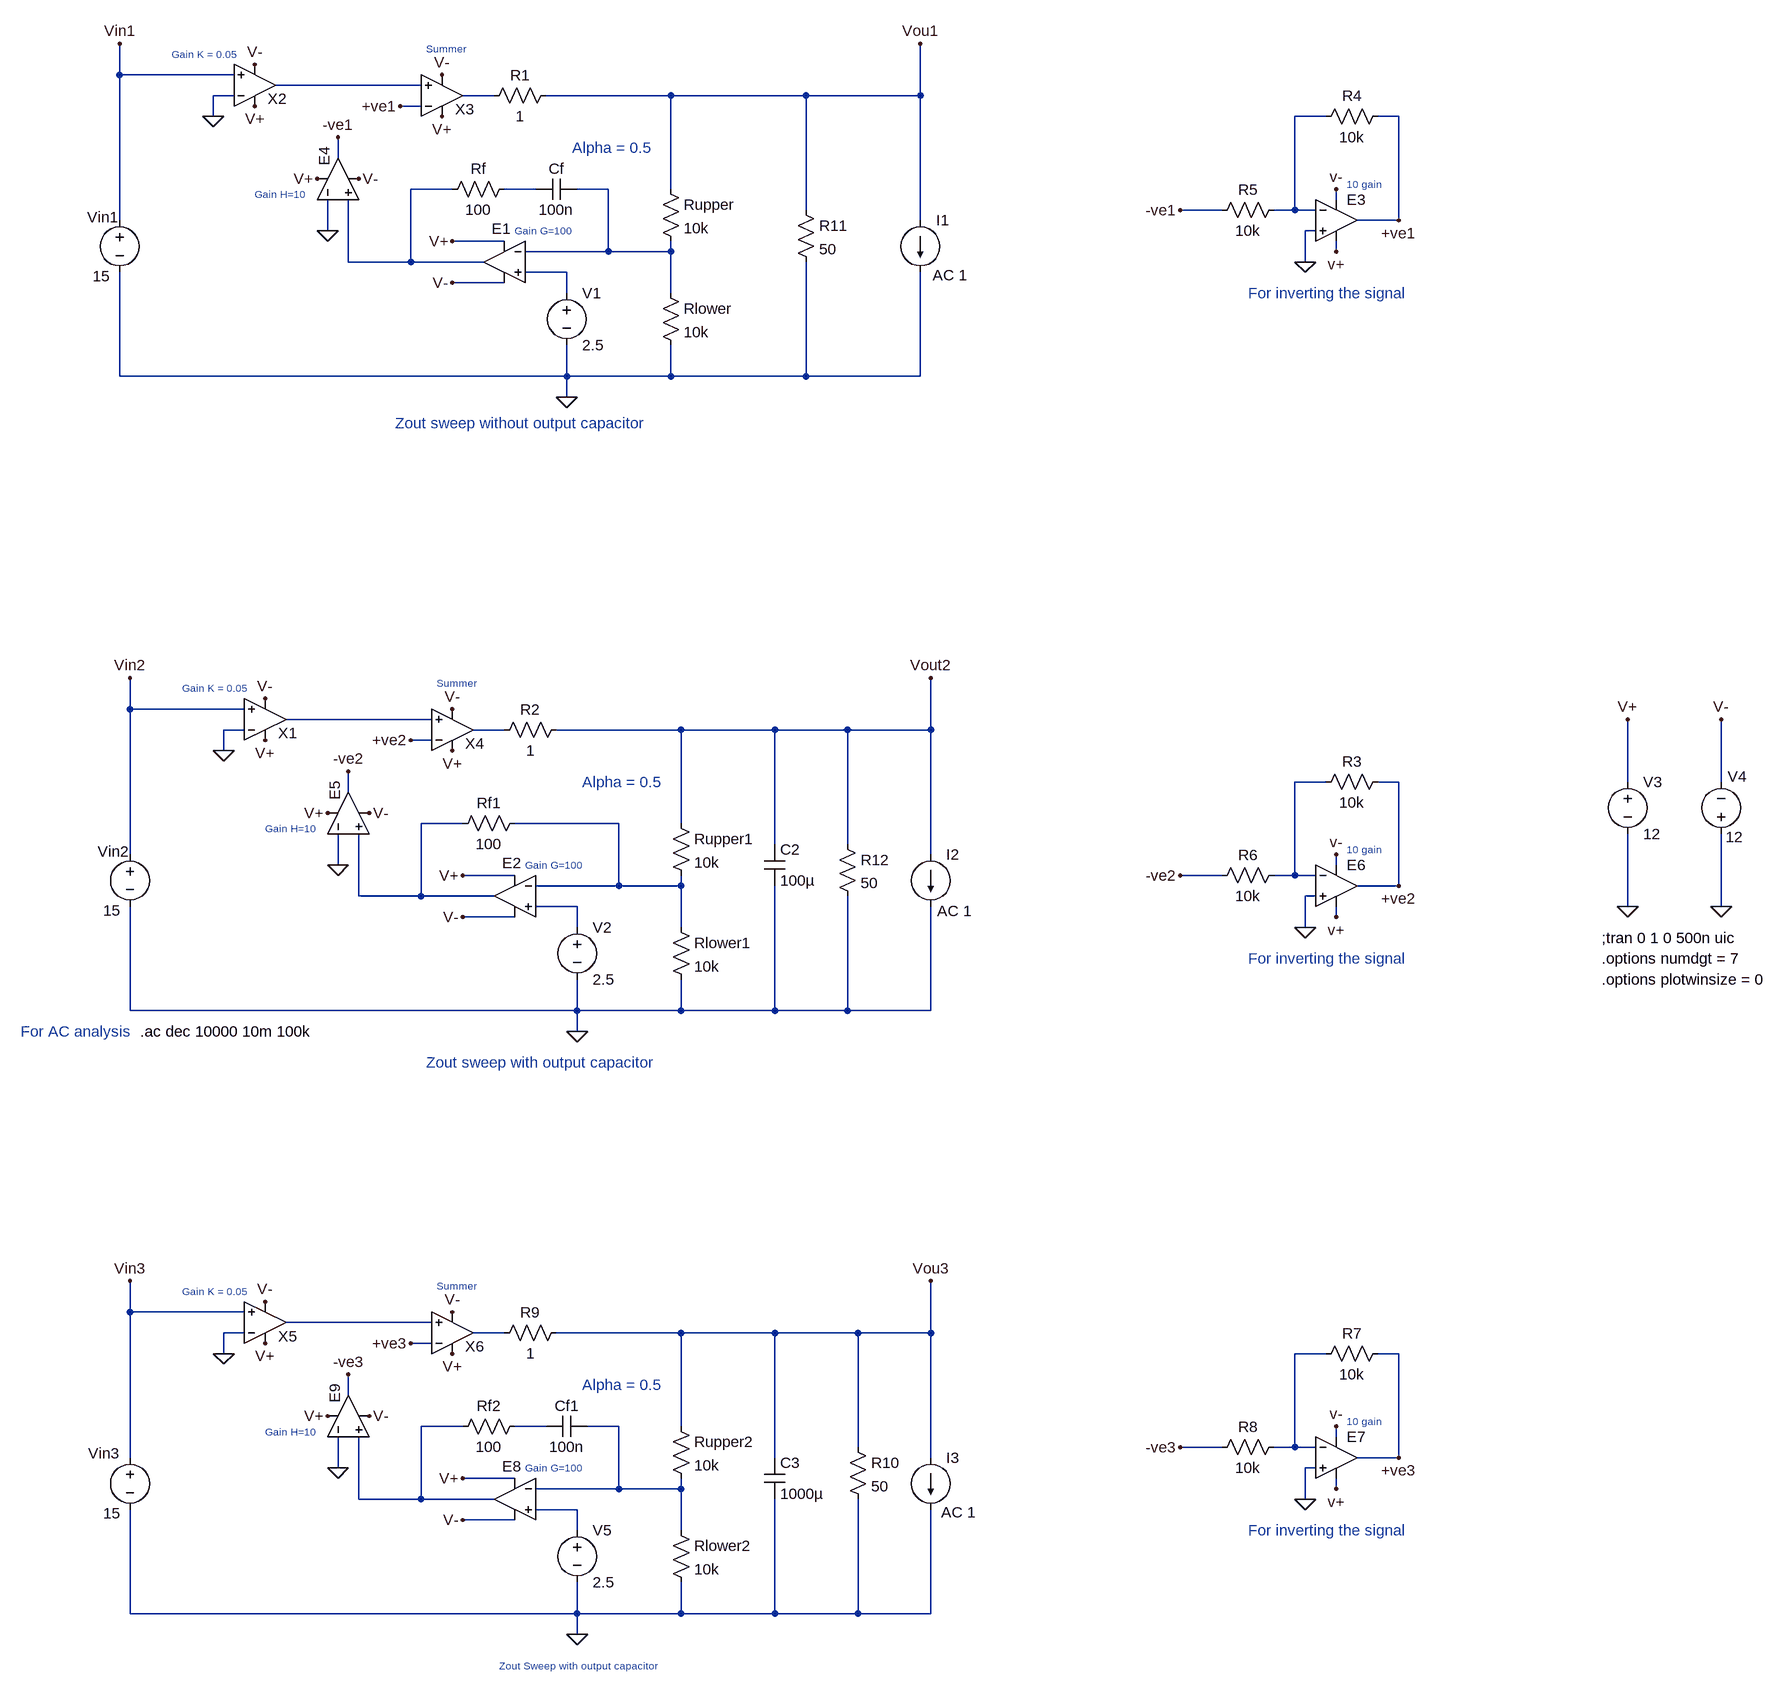
[diagram p0: schematic LDO - Closed Loop_Capacitor Sweep.asc]
LDO - Closed Loop_Capacitor Sweep.asc, the LTspice schematic file:
Version 4
SHEET 1 2436 2412
WIRE -416 -80 -416 -128
WIRE -240 -80 -416 -80
WIRE 48 -64 -176 -64
WIRE -240 -48 -272 -48
WIRE 160 -48 112 -48
WIRE 432 -48 240 -48
WIRE 640 -48 432 -48
WIRE 816 -48 816 -128
WIRE 816 -48 640 -48
WIRE 48 -32 16 -32
WIRE -272 -16 -272 -48
WIRE 1440 -16 1392 -16
WIRE 1552 -16 1520 -16
WIRE -80 48 -80 16
WIRE 96 96 32 96
WIRE 224 96 176 96
WIRE 336 96 288 96
WIRE 432 96 432 -48
WIRE 1456 112 1456 96
WIRE 640 128 640 -48
WIRE 1280 128 1216 128
WIRE 1392 128 1392 -16
WIRE 1392 128 1360 128
WIRE 1424 128 1392 128
WIRE -416 144 -416 -80
WIRE 816 144 816 -48
WIRE 1552 144 1552 -16
WIRE 1552 144 1488 144
WIRE -96 160 -96 112
WIRE 1424 160 1408 160
WIRE 176 176 96 176
WIRE 336 192 336 96
WIRE 336 192 208 192
WIRE 432 192 432 176
WIRE 432 192 336 192
WIRE 1456 192 1456 176
WIRE -64 208 -64 112
WIRE 32 208 32 96
WIRE 32 208 -64 208
WIRE 144 208 32 208
WIRE 1408 208 1408 160
WIRE 272 224 208 224
WIRE 176 240 96 240
WIRE 272 256 272 224
WIRE 432 256 432 192
WIRE -416 384 -416 224
WIRE 272 384 272 336
WIRE 272 384 -416 384
WIRE 432 384 432 336
WIRE 432 384 272 384
WIRE 640 384 640 208
WIRE 640 384 432 384
WIRE 816 384 816 224
WIRE 816 384 640 384
WIRE 272 416 272 384
WIRE -400 896 -400 848
WIRE -224 896 -400 896
WIRE 64 912 -160 912
WIRE -224 928 -256 928
WIRE 176 928 128 928
WIRE 448 928 256 928
WIRE 592 928 448 928
WIRE 704 928 592 928
WIRE 832 928 832 848
WIRE 832 928 704 928
WIRE 64 944 32 944
WIRE -256 960 -256 928
WIRE 1440 1008 1392 1008
WIRE 1552 1008 1520 1008
WIRE 1904 1008 1904 912
WIRE 2048 1008 2048 912
WIRE -64 1024 -64 992
WIRE 112 1072 48 1072
WIRE 352 1072 192 1072
WIRE 448 1072 448 928
WIRE 592 1104 592 928
WIRE 704 1104 704 928
WIRE -400 1120 -400 896
WIRE 832 1120 832 928
WIRE -80 1136 -80 1088
WIRE 1456 1136 1456 1120
WIRE 192 1152 112 1152
WIRE 1280 1152 1216 1152
WIRE 1392 1152 1392 1008
WIRE 1392 1152 1360 1152
WIRE 1424 1152 1392 1152
WIRE 352 1168 352 1072
WIRE 352 1168 224 1168
WIRE 448 1168 448 1152
WIRE 448 1168 352 1168
WIRE 1552 1168 1552 1008
WIRE 1552 1168 1488 1168
WIRE -48 1184 -48 1088
WIRE 48 1184 48 1072
WIRE 48 1184 -48 1184
WIRE 160 1184 48 1184
WIRE 1424 1184 1408 1184
WIRE 288 1200 224 1200
WIRE 1904 1200 1904 1088
WIRE 2048 1200 2048 1088
WIRE 192 1216 112 1216
WIRE 1456 1216 1456 1200
WIRE 288 1232 288 1200
WIRE 448 1232 448 1168
WIRE 1408 1232 1408 1184
WIRE -400 1360 -400 1200
WIRE 288 1360 288 1312
WIRE 288 1360 -400 1360
WIRE 448 1360 448 1312
WIRE 448 1360 288 1360
WIRE 592 1360 592 1168
WIRE 592 1360 448 1360
WIRE 704 1360 704 1184
WIRE 704 1360 592 1360
WIRE 832 1360 832 1200
WIRE 832 1360 704 1360
WIRE 288 1392 288 1360
WIRE -400 1824 -400 1776
WIRE -224 1824 -400 1824
WIRE 64 1840 -160 1840
WIRE -224 1856 -256 1856
WIRE 176 1856 128 1856
WIRE 448 1856 256 1856
WIRE 592 1856 448 1856
WIRE 720 1856 592 1856
WIRE 832 1856 832 1776
WIRE 832 1856 720 1856
WIRE 64 1872 32 1872
WIRE -256 1888 -256 1856
WIRE 1440 1888 1392 1888
WIRE 1552 1888 1520 1888
WIRE -64 1952 -64 1920
WIRE 112 2000 48 2000
WIRE 240 2000 192 2000
WIRE 352 2000 304 2000
WIRE 448 2000 448 1856
WIRE 1456 2016 1456 2000
WIRE 720 2032 720 1856
WIRE 1280 2032 1216 2032
WIRE 1392 2032 1392 1888
WIRE 1392 2032 1360 2032
WIRE 1424 2032 1392 2032
WIRE -400 2048 -400 1824
WIRE 592 2048 592 1856
WIRE 832 2048 832 1856
WIRE 1552 2048 1552 1888
WIRE 1552 2048 1488 2048
WIRE -80 2064 -80 2016
WIRE 1424 2064 1408 2064
WIRE 192 2080 112 2080
WIRE 352 2096 352 2000
WIRE 352 2096 224 2096
WIRE 448 2096 448 2080
WIRE 448 2096 352 2096
WIRE 1456 2096 1456 2080
WIRE -48 2112 -48 2016
WIRE 48 2112 48 2000
WIRE 48 2112 -48 2112
WIRE 160 2112 48 2112
WIRE 1408 2112 1408 2064
WIRE 288 2128 224 2128
WIRE 192 2144 112 2144
WIRE 288 2160 288 2128
WIRE 448 2160 448 2096
WIRE -400 2288 -400 2128
WIRE 288 2288 288 2240
WIRE 288 2288 -400 2288
WIRE 448 2288 448 2240
WIRE 448 2288 288 2288
WIRE 592 2288 592 2112
WIRE 592 2288 448 2288
WIRE 720 2288 720 2112
WIRE 720 2288 592 2288
WIRE 832 2288 832 2128
WIRE 832 2288 720 2288
WIRE 288 2320 288 2288
FLAG 96 176 V+
FLAG 96 240 V-
FLAG 1904 1200 0
FLAG 2048 1200 0
FLAG 1904 912 V+
FLAG 2048 912 V-
FLAG 272 416 0
FLAG 1408 208 0
FLAG 1552 144 +ve1
FLAG 1456 96 v-
FLAG 1456 192 v+
FLAG 1216 128 -ve1
FLAG -96 160 0
FLAG -112 80 V+
FLAG -48 80 V-
FLAG -80 16 -ve1
FLAG -208 -32 V+
FLAG -208 -96 V-
FLAG -272 -16 0
FLAG 80 -16 V+
FLAG 80 -80 V-
FLAG 16 -32 +ve1
FLAG 816 -128 Vou1
FLAG -416 -128 Vin1
FLAG 112 1152 V+
FLAG 112 1216 V-
FLAG 288 1392 0
FLAG -80 1136 0
FLAG -96 1056 V+
FLAG -32 1056 V-
FLAG -64 992 -ve2
FLAG -192 944 V+
FLAG -192 880 V-
FLAG -256 960 0
FLAG 96 960 V+
FLAG 96 896 V-
FLAG 32 944 +ve2
FLAG 832 848 Vout2
FLAG -400 848 Vin2
FLAG 1408 1232 0
FLAG 1552 1168 +ve2
FLAG 1456 1120 v-
FLAG 1456 1216 v+
FLAG 1216 1152 -ve2
FLAG 112 2080 V+
FLAG 112 2144 V-
FLAG 288 2320 0
FLAG 1408 2112 0
FLAG 1552 2048 +ve3
FLAG 1456 2000 v-
FLAG 1456 2096 v+
FLAG 1216 2032 -ve3
FLAG -80 2064 0
FLAG -96 1984 V+
FLAG -32 1984 V-
FLAG -64 1920 -ve3
FLAG -192 1872 V+
FLAG -192 1808 V-
FLAG -256 1888 0
FLAG 96 1888 V+
FLAG 96 1824 V-
FLAG 32 1872 +ve3
FLAG 832 1776 Vou3
FLAG -400 1776 Vin3
SYMBOL voltage -416 128 R0
WINDOW 123 0 0 Left 0
WINDOW 39 0 0 Left 0
WINDOW 0 -50 11 Left 2
WINDOW 3 -41 102 Left 2
SYMATTR InstName Vin1
SYMATTR Value 15
SYMBOL voltage 272 240 R0
WINDOW 123 0 0 Left 0
WINDOW 39 0 0 Left 0
SYMATTR InstName V1
SYMATTR Value 2.5
SYMBOL res 416 80 R0
SYMATTR InstName Rupper
SYMATTR Value 10k
SYMBOL res 416 240 R0
SYMATTR InstName Rlower
SYMATTR Value 10k
SYMBOL voltage 1904 992 R0
SYMATTR InstName V3
SYMATTR Value 12
SYMBOL voltage 2048 1104 R180
WINDOW 123 0 0 Left 0
WINDOW 39 0 0 Left 0
WINDOW 0 -39 104 Left 2
WINDOW 3 -34 11 Left 2
SYMATTR InstName V4
SYMATTR Value 12
SYMBOL OpAmps\\UniversalOpAmp1 1456 144 R0
SYMATTR InstName E3
SYMATTR Value2 Avol=10 GBW=10Meg Vos=0
SYMBOL res 1536 -32 R90
WINDOW 0 0 56 VBottom 2
WINDOW 3 32 56 VTop 2
SYMATTR InstName R4
SYMATTR Value 10k
SYMBOL res 1376 112 R90
WINDOW 0 0 56 VBottom 2
WINDOW 3 32 56 VTop 2
SYMATTR InstName R5
SYMATTR Value 10k
SYMBOL OpAmps\\UniversalOpAmp1 176 208 M0
WINDOW 0 -10 -51 Left 2
SYMATTR InstName E1
SYMATTR Value2 Avol=100 GBW=10Meg Vos=0
SYMBOL cap 288 80 R90
WINDOW 0 0 32 VBottom 2
WINDOW 3 32 32 VTop 2
SYMATTR InstName Cf
SYMATTR Value 100n
SYMBOL res 192 80 R90
WINDOW 0 0 56 VBottom 2
WINDOW 3 32 56 VTop 2
SYMATTR InstName Rf
SYMATTR Value 100
SYMBOL OpAmps\\UniversalOpAmp1 -80 80 R270
WINDOW 0 20 -21 Left 2
SYMATTR InstName E4
SYMATTR Value2 Avol=100 GBW=10Meg Vos=0
SYMBOL OpAmps\\UniversalOpAmp1 -208 -64 M180
WINDOW 0 20 -21 Left 2
SYMATTR InstName X2
SYMATTR Value2 Avol=0.05 GBW=10Meg Vos=0
SYMBOL OpAmps\\UniversalOpAmp1 80 -48 M180
WINDOW 0 20 -21 Left 2
SYMATTR InstName X3
SYMATTR Value2 Avol=1 GBW=10Meg Vos=0
SYMBOL res 256 -64 R90
WINDOW 0 0 56 VBottom 2
WINDOW 3 32 56 VTop 2
SYMATTR InstName R1
SYMATTR Value 1
SYMBOL current 816 144 R0
WINDOW 123 19 84 Left 2
WINDOW 39 0 0 Left 0
SYMATTR Value2 AC 1
SYMATTR InstName I1
SYMATTR Value ""
SYMBOL voltage -400 1104 R0
WINDOW 123 0 0 Left 0
WINDOW 39 0 0 Left 0
WINDOW 0 -50 11 Left 2
WINDOW 3 -41 102 Left 2
SYMATTR InstName Vin2
SYMATTR Value 15
SYMBOL voltage 288 1216 R0
WINDOW 123 0 0 Left 0
WINDOW 39 0 0 Left 0
SYMATTR InstName V2
SYMATTR Value 2.5
SYMBOL res 432 1056 R0
SYMATTR InstName Rupper1
SYMATTR Value 10k
SYMBOL res 432 1216 R0
SYMATTR InstName Rlower1
SYMATTR Value 10k
SYMBOL OpAmps\\UniversalOpAmp1 192 1184 M0
WINDOW 0 -10 -51 Left 2
SYMATTR InstName E2
SYMATTR Value2 Avol=100 GBW=10Meg Vos=0
SYMBOL res 208 1056 R90
WINDOW 0 0 56 VBottom 2
WINDOW 3 32 56 VTop 2
SYMATTR InstName Rf1
SYMATTR Value 100
SYMBOL OpAmps\\UniversalOpAmp1 -64 1056 R270
WINDOW 0 20 -21 Left 2
SYMATTR InstName E5
SYMATTR Value2 Avol=100 GBW=10Meg Vos=0
SYMBOL OpAmps\\UniversalOpAmp1 -192 912 M180
WINDOW 0 20 -21 Left 2
SYMATTR InstName X1
SYMATTR Value2 Avol=0.05 GBW=10Meg Vos=0
SYMBOL OpAmps\\UniversalOpAmp1 96 928 M180
WINDOW 0 20 -21 Left 2
SYMATTR InstName X4
SYMATTR Value2 Avol=1 GBW=10Meg Vos=0
SYMBOL res 272 912 R90
WINDOW 0 0 56 VBottom 2
WINDOW 3 32 56 VTop 2
SYMATTR InstName R2
SYMATTR Value 1
SYMBOL cap 576 1104 R0
SYMATTR InstName C2
SYMATTR Value 100µ
SYMBOL current 832 1120 R0
WINDOW 3 24 80 Invisible 2
WINDOW 123 10 87 Left 2
WINDOW 39 0 0 Left 0
SYMATTR Value ""
SYMATTR Value2 AC 1
SYMATTR InstName I2
SYMBOL OpAmps\\UniversalOpAmp1 1456 1168 R0
SYMATTR InstName E6
SYMATTR Value2 Avol=10 GBW=10Meg Vos=0
SYMBOL res 1536 992 R90
WINDOW 0 0 56 VBottom 2
WINDOW 3 32 56 VTop 2
SYMATTR InstName R3
SYMATTR Value 10k
SYMBOL res 1376 1136 R90
WINDOW 0 0 56 VBottom 2
WINDOW 3 32 56 VTop 2
SYMATTR InstName R6
SYMATTR Value 10k
SYMBOL voltage -400 2032 R0
WINDOW 123 0 0 Left 0
WINDOW 39 0 0 Left 0
WINDOW 0 -64 9 Left 2
WINDOW 3 -41 102 Left 2
SYMATTR InstName Vin3
SYMATTR Value 15
SYMBOL voltage 288 2144 R0
WINDOW 123 0 0 Left 0
WINDOW 39 0 0 Left 0
SYMATTR InstName V5
SYMATTR Value 2.5
SYMBOL res 432 1984 R0
SYMATTR InstName Rupper2
SYMATTR Value 10k
SYMBOL res 432 2144 R0
SYMATTR InstName Rlower2
SYMATTR Value 10k
SYMBOL OpAmps\\UniversalOpAmp1 1456 2048 R0
SYMATTR InstName E7
SYMATTR Value2 Avol=10 GBW=10Meg Vos=0
SYMBOL res 1536 1872 R90
WINDOW 0 0 56 VBottom 2
WINDOW 3 32 56 VTop 2
SYMATTR InstName R7
SYMATTR Value 10k
SYMBOL res 1376 2016 R90
WINDOW 0 0 56 VBottom 2
WINDOW 3 32 56 VTop 2
SYMATTR InstName R8
SYMATTR Value 10k
SYMBOL OpAmps\\UniversalOpAmp1 192 2112 M0
WINDOW 0 -10 -51 Left 2
SYMATTR InstName E8
SYMATTR Value2 Avol=100 GBW=10Meg Vos=0
SYMBOL cap 304 1984 R90
WINDOW 0 0 32 VBottom 2
WINDOW 3 32 32 VTop 2
SYMATTR InstName Cf1
SYMATTR Value 100n
SYMBOL res 208 1984 R90
WINDOW 0 0 56 VBottom 2
WINDOW 3 32 56 VTop 2
SYMATTR InstName Rf2
SYMATTR Value 100
SYMBOL OpAmps\\UniversalOpAmp1 -64 1984 R270
WINDOW 0 20 -21 Left 2
SYMATTR InstName E9
SYMATTR Value2 Avol=100 GBW=10Meg Vos=0
SYMBOL OpAmps\\UniversalOpAmp1 -192 1840 M180
WINDOW 0 20 -21 Left 2
SYMATTR InstName X5
SYMATTR Value2 Avol=0.05 GBW=10Meg Vos=0
SYMBOL OpAmps\\UniversalOpAmp1 96 1856 M180
WINDOW 0 20 -21 Left 2
SYMATTR InstName X6
SYMATTR Value2 Avol=1 GBW=10Meg Vos=0
SYMBOL res 272 1840 R90
WINDOW 0 0 56 VBottom 2
WINDOW 3 32 56 VTop 2
SYMATTR InstName R9
SYMATTR Value 1
SYMBOL cap 576 2048 R0
SYMATTR InstName C3
SYMATTR Value 1000µ
SYMBOL current 832 2048 R0
WINDOW 123 16 84 Left 2
WINDOW 39 0 0 Left 0
SYMATTR Value2 AC 1
SYMATTR InstName I3
SYMATTR Value ""
SYMBOL res 704 2016 R0
SYMATTR InstName R10
SYMATTR Value 50
SYMBOL res 624 112 R0
SYMATTR InstName R11
SYMATTR Value 50
SYMBOL res 688 1088 R0
SYMATTR InstName R12
SYMATTR Value 50
TEXT 1864 1248 Left 2 !;tran 0 1 0 500n uic
TEXT 192 160 Left 1 ;Gain G=100
TEXT 1864 1280 Left 2 !.options numdgt = 7
TEXT 1864 1312 Left 2 !.options plotwinsize = 0
TEXT -208 104 Left 1 ;Gain H=10
TEXT -336 -112 Left 1 ;Gain K = 0.05
TEXT 56 -120 Left 1 ;Summer
TEXT 1472 88 Left 1 ;10 gain
TEXT 280 32 Left 2 ;Alpha = 0.5
TEXT 1320 256 Left 2 ;For inverting the signal
TEXT 8 456 Left 2 ;Zout sweep without output capacitor
TEXT 208 1136 Left 1 ;Gain G=100
TEXT -192 1080 Left 1 ;Gain H=10
TEXT -320 864 Left 1 ;Gain K = 0.05
TEXT 72 856 Left 1 ;Summer
TEXT 296 1008 Left 2 ;Alpha = 0.5
TEXT 1472 1112 Left 1 ;10 gain
TEXT 1320 1280 Left 2 ;For inverting the signal
TEXT 208 2064 Left 1 ;Gain G=100
TEXT -192 2008 Left 1 ;Gain H=10
TEXT -320 1792 Left 1 ;Gain K = 0.05
TEXT 72 1784 Left 1 ;Summer
TEXT 1472 1992 Left 1 ;10 gain
TEXT 296 1936 Left 2 ;Alpha = 0.5
TEXT 1320 2160 Left 2 ;For inverting the signal
TEXT 168 2368 Left 1 ;Zout Sweep with output capacitor
TEXT 56 1440 Left 2 ;Zout sweep with output capacitor
TEXT -384 1392 Left 2 !.ac dec 10000 10m 100k
TEXT -568 1392 Left 2 ;For AC analysis

The netlist it stands for:
* LDO - Closed Loop_Capacitor Sweep.asc
Vin1 Vin1 0 15
V1 N007 0 2.5
Rupper Vou1 N006 10k
Rlower N006 0 10k
V3 V+ 0 12
V4 0 V- 12
XE3 0 N003 V- V+ +ve1 level1 Avol=10 GBW=10Meg Vos=0 En=0 Enk=0 In=0 Ink=0 Rin=500Meg  ; pins In+ In- V+ V- OUT
R4 +ve1 N003 10k
R5 N003 -ve1 10k
XE1 N007 N006 V+ V- N004 level1 Avol=100 GBW=10Meg Vos=0 En=0 Enk=0 In=0 Ink=0 Rin=500Meg  ; pins In+ In- V+ V- OUT
Cf N006 N005 100n
Rf N005 N004 100
XE4 N004 0 V+ V- -ve1 level1 Avol=100 GBW=10Meg Vos=0 En=0 Enk=0 In=0 Ink=0 Rin=500Meg  ; pins In+ In- V+ V- OUT
XX2 Vin1 0 V+ V- N001 level1 Avol=0.05 GBW=10Meg Vos=0 En=0 Enk=0 In=0 Ink=0 Rin=500Meg  ; pins In+ In- V+ V- OUT
XX3 N001 +ve1 V+ V- N002 level1 Avol=1 GBW=10Meg Vos=0 En=0 Enk=0 In=0 Ink=0 Rin=500Meg  ; pins In+ In- V+ V- OUT
R1 Vou1 N002 1
I1 Vou1 0 AC 1
Vin2 Vin2 0 15
V2 N013 0 2.5
Rupper1 Vout2 N012 10k
Rlower1 N012 0 10k
XE2 N013 N012 V+ V- N011 level1 Avol=100 GBW=10Meg Vos=0 En=0 Enk=0 In=0 Ink=0 Rin=500Meg  ; pins In+ In- V+ V- OUT
Rf1 N012 N011 100
XE5 N011 0 V+ V- -ve2 level1 Avol=100 GBW=10Meg Vos=0 En=0 Enk=0 In=0 Ink=0 Rin=500Meg  ; pins In+ In- V+ V- OUT
XX1 Vin2 0 V+ V- N008 level1 Avol=0.05 GBW=10Meg Vos=0 En=0 Enk=0 In=0 Ink=0 Rin=500Meg  ; pins In+ In- V+ V- OUT
XX4 N008 +ve2 V+ V- N009 level1 Avol=1 GBW=10Meg Vos=0 En=0 Enk=0 In=0 Ink=0 Rin=500Meg  ; pins In+ In- V+ V- OUT
R2 Vout2 N009 1
C2 Vout2 0 100µ
I2 Vout2 0 AC 1
XE6 0 N010 V- V+ +ve2 level1 Avol=10 GBW=10Meg Vos=0 En=0 Enk=0 In=0 Ink=0 Rin=500Meg  ; pins In+ In- V+ V- OUT
R3 +ve2 N010 10k
R6 N010 -ve2 10k
Vin3 Vin3 0 15
V5 N020 0 2.5
Rupper2 Vou3 N019 10k
Rlower2 N019 0 10k
XE7 0 N016 V- V+ +ve3 level1 Avol=10 GBW=10Meg Vos=0 En=0 Enk=0 In=0 Ink=0 Rin=500Meg  ; pins In+ In- V+ V- OUT
R7 +ve3 N016 10k
R8 N016 -ve3 10k
XE8 N020 N019 V+ V- N017 level1 Avol=100 GBW=10Meg Vos=0 En=0 Enk=0 In=0 Ink=0 Rin=500Meg  ; pins In+ In- V+ V- OUT
Cf1 N019 N018 100n
Rf2 N018 N017 100
XE9 N017 0 V+ V- -ve3 level1 Avol=100 GBW=10Meg Vos=0 En=0 Enk=0 In=0 Ink=0 Rin=500Meg  ; pins In+ In- V+ V- OUT
XX5 Vin3 0 V+ V- N014 level1 Avol=0.05 GBW=10Meg Vos=0 En=0 Enk=0 In=0 Ink=0 Rin=500Meg  ; pins In+ In- V+ V- OUT
XX6 N014 +ve3 V+ V- N015 level1 Avol=1 GBW=10Meg Vos=0 En=0 Enk=0 In=0 Ink=0 Rin=500Meg  ; pins In+ In- V+ V- OUT
R9 Vou3 N015 1
C3 Vou3 0 1000µ
I3 Vou3 0 AC 1
R10 Vou3 0 50
R11 Vou1 0 50
R12 Vout2 0 50
;tran 0 1 0 500n uic
* Gain G=100
.options numdgt = 7
.options plotwinsize = 0
* Gain H=10
* Gain K = 0.05
* Summer
* 10 gain
* Alpha = 0.5
* For inverting the signal
* Zout sweep without output capacitor
* Gain G=100
* Gain H=10
* Gain K = 0.05
* Summer
* Alpha = 0.5
* 10 gain
* For inverting the signal
* Gain G=100
* Gain H=10
* Gain K = 0.05
* Summer
* 10 gain
* Alpha = 0.5
* For inverting the signal
* Zout Sweep with output capacitor
* Zout sweep with output capacitor
.ac dec 10000 10m 100k
* For AC analysis
.lib UniversalOpAmp1.lib
.backanno
.end